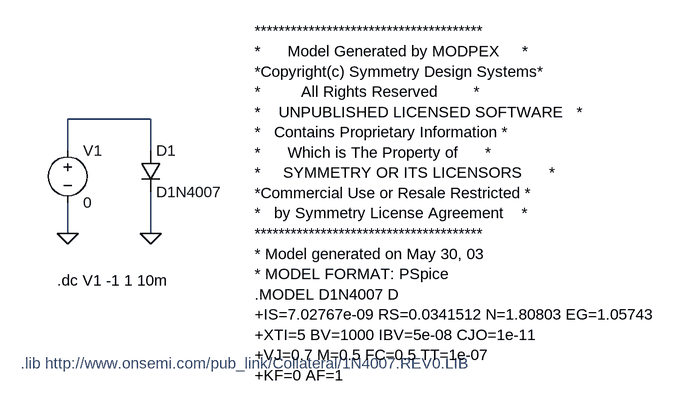
[diagram p0: schematic 1N4007.asc]
1N4007.asc, the LTspice schematic file:
Version 4
SHEET 1 1540 680
WIRE 192 64 64 64
WIRE 64 112 64 64
WIRE 192 112 192 64
WIRE 64 240 64 192
WIRE 192 240 192 176
FLAG 64 240 0
FLAG 192 240 0
SYMBOL diode 176 112 R0
SYMATTR InstName D1
SYMATTR Value D1N4007
SYMBOL voltage 64 96 R0
SYMATTR InstName V1
SYMATTR Value 0
TEXT -8 440 Left 0 ;.lib http://www.onsemi.com/pub_link/Collateral/1N4007.REV0.LIB
TEXT 48 312 Left 0 !.dc V1 -1 1 10m
TEXT 352 -72 Left 0 !**************************************\n*      Model Generated by MODPEX     *\n*Copyright(c) Symmetry Design Systems*\n*         All Rights Reserved        *\n*    UNPUBLISHED LICENSED SOFTWARE   *\n*   Contains Proprietary Information *\n*      Which is The Property of      *\n*     SYMMETRY OR ITS LICENSORS      *\n*Commercial Use or Resale Restricted *\n*   by Symmetry License Agreement    *\n**************************************\n* Model generated on May 30, 03\n* MODEL FORMAT: PSpice\n.MODEL D1N4007 D\n+IS=7.02767e-09 RS=0.0341512 N=1.80803 EG=1.05743\n+XTI=5 BV=1000 IBV=5e-08 CJO=1e-11\n+VJ=0.7 M=0.5 FC=0.5 TT=1e-07\n+KF=0 AF=1

The netlist it stands for:
* 1N4007.asc
D1 N001 0 D1N4007
V1 N001 0 0
.model D D
.lib standard.dio
* .lib http://www.onsemi.com/pub_link/Collateral/1N4007.REV0.LIB
.dc V1 -1 1 10m
**************************************
*      Model Generated by MODPEX     *
*Copyright(c) Symmetry Design Systems*
*         All Rights Reserved        *
*    UNPUBLISHED LICENSED SOFTWARE   *
*   Contains Proprietary Information *
*      Which is The Property of      *
*     SYMMETRY OR ITS LICENSORS      *
*Commercial Use or Resale Restricted *
*   by Symmetry License Agreement    *
**************************************
* Model generated on May 30, 03
* MODEL FORMAT: PSpice
.MODEL D1N4007 D
+IS=7.02767e-09 RS=0.0341512 N=1.80803 EG=1.05743
+XTI=5 BV=1000 IBV=5e-08 CJO=1e-11
+VJ=0.7 M=0.5 FC=0.5 TT=1e-07
+KF=0 AF=1
.backanno
.end